# Altium schematic sheet Sensors.SchDoc
size A3
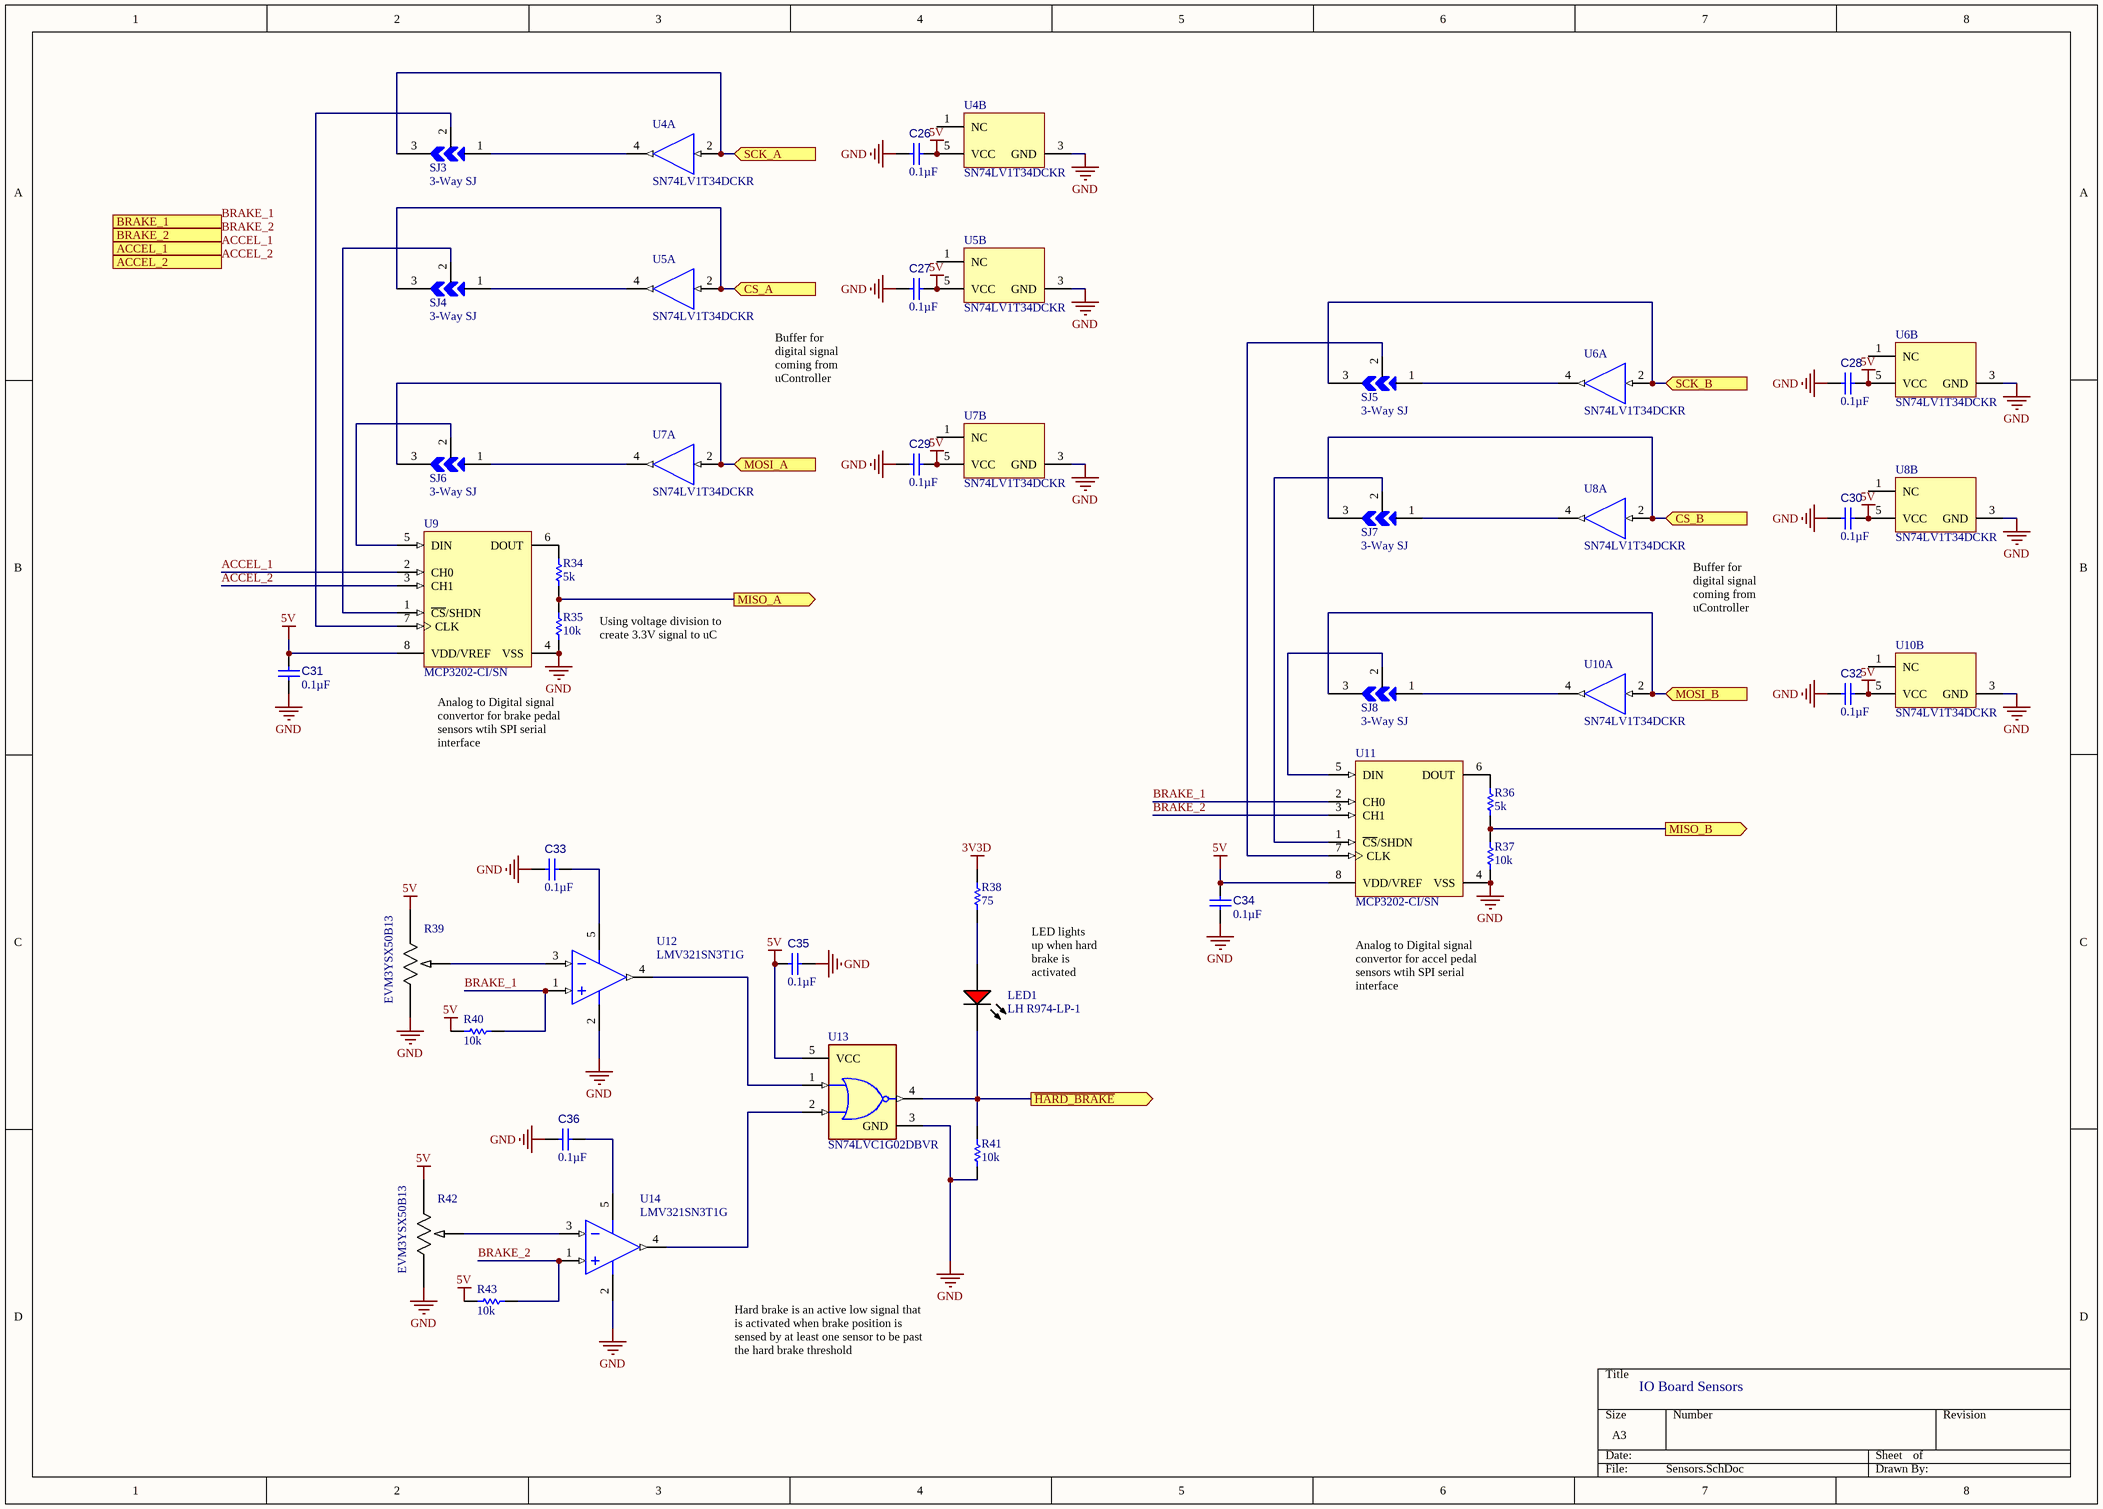
[diagram p0: Sensors.SchDoc]

## Parts
C26  0.1µF  [CAPC2013X145X50ML20T25]
C27  0.1µF  [CAPC2013X145X50ML20T25]
C28  0.1µF  [CAPC2013X145X50ML20T25]
C29  0.1µF  [CAPC2013X145X50ML20T25]
C30  0.1µF  [CAPC2013X145X50ML20T25]
C31  0.1µF  [CAPC2013X145X50ML20T25]
C32  0.1µF  [CAPC2013X145X50ML20T25]
C33  0.1µF  [CAPC2013X145X50ML20T25]
C34  0.1µF  [CAPC2013X145X50ML20T25]
C35  0.1µF  [CAPC2013X145X50ML20T25]
C36  0.1µF  [CAPC2013X145X50ML20T25]
LED1  LH R974-LP-1  [0805_A]
R34  5k  [RESC2013X50X35ML15T15]
R35  10k  [RESC2013X50X35ML15T15]
R36  5k  [RESC2013X50X35ML15T15]
R37  10k  [RESC2013X50X35ML15T15]
R38  75  [RESC2013X50X35ML15T15]
R39  EVM3YSX50B13  [POT_EVM3Y_PAN]
R40  10k  [RESC2013X50X35ML15T15]
R41  10k  [RESC2013X50X35ML15T15]
R42  EVM3YSX50B13  [POT_EVM3Y_PAN]
R43  10k  [RESC2013X50X35ML15T15]
SJ3  3-Way SJ  [3-Way SJ]
SJ4  3-Way SJ  [3-Way SJ]
SJ5  3-Way SJ  [3-Way SJ]
SJ6  3-Way SJ  [3-Way SJ]
SJ7  3-Way SJ  [3-Way SJ]
SJ8  3-Way SJ  [3-Way SJ]
U4  SN74LV1T34DCKR  [DCK0005A_L]  (parts A,B of 2)
U5  SN74LV1T34DCKR  [DCK0005A_L]  (parts A,B of 2)
U6  SN74LV1T34DCKR  [DCK0005A_L]  (parts A,B of 2)
U7  SN74LV1T34DCKR  [DCK0005A_L]  (parts A,B of 2)
U8  SN74LV1T34DCKR  [DCK0005A_L]  (parts A,B of 2)
U9  MCP3202-CI/SN  [SOIC-SN8_L]
U10  SN74LV1T34DCKR  [DCK0005A_L]  (parts A,B of 2)
U11  MCP3202-CI/SN  [SOIC-SN8_L]
U12  LMV321SN3T1G  [ONSC-TSOP-5-483-02_V]
U13  SN74LVC1G02DBVR  [FP-DBV0005A-MFG]
U14  LMV321SN3T1G  [ONSC-TSOP-5-483-02_V]

## Ports
ACCEL_1 (in), ACCEL_2 (in), BRAKE_1 (in), BRAKE_2 (in), CS_A (in), CS_B (in), MISO_A (out), MISO_B (out), MOSI_A (in), MOSI_B (in), SCK_A (in), SCK_B (in), ~{HARD_BRAKE} (out)

## Nets
3V3D: R38.1
5V: C26.1 C27.1 C28.1 C29.1 C30.1 C31.2 C32.1 C34.2 C35.2 R39.1 R40.2 R42.1 R43.2 U4.5(VCC) U5.5(VCC) U6.5(VCC) U7.5(VCC) U8.5(VCC) U9.8(VDD/VREF) U10.5(VCC) U11.8(VDD/VREF) U13.5(VCC)
GND: C26.2 C27.2 C28.2 C29.2 C30.2 C31.1 C32.2 C33.2 C34.1 C35.1 C36.2 R35.1 R37.1 R39.3 R41.1 R42.3 U4.3(GND) U5.3(GND) U6.3(GND) U7.3(GND) U8.3(GND) U9.4(VSS) U10.3(GND) U11.4(VSS) U12.2(V-) U13.3(GND) U14.2(V-)
ACCEL_1: U9.2(CH0) ; port ACCEL_1
ACCEL_2: U9.3(CH1) ; port ACCEL_2
BRAKE_1: R40.1 U11.2(CH0) U12.1(IN+) ; port BRAKE_1
BRAKE_2: R43.1 U11.3(CH1) U14.1(IN+) ; port BRAKE_2
CS_A: SJ4.3 U5.2(A) ; port CS_A
CS_B: SJ7.3 U8.2(A) ; port CS_B
~{HARD_BRAKE}: LED1.1(K) R41.2 U13.4(Y) ; port ~{HARD_BRAKE}
MISO_A: R34.2 R35.2 ; port MISO_A
MISO_B: R36.2 R37.2 ; port MISO_B
MOSI_A: SJ6.3 U7.2(A) ; port MOSI_A
MOSI_B: SJ8.3 U10.2(A) ; port MOSI_B
SCK_A: SJ3.3 U4.2(A) ; port SCK_A
SCK_B: SJ5.3 U6.2(A) ; port SCK_B
NetC33_1: C33.1 U12.5(V+)
NetC36_1: C36.1 U14.5(V+)
NetLED1_2: LED1.2(A) R38.2
NetR34_1: R34.1 U9.6(DOUT)
NetR36_1: R36.1 U11.6(DOUT)
NetR39_2: R39.2 U12.3(IN-)
NetR42_2: R42.2 U14.3(IN-)
NetSJ3_1: SJ3.1 U4.4(Y)
NetSJ3_2: SJ3.2 U9.7(CLK)
NetSJ4_1: SJ4.1 U5.4(Y)
NetSJ4_2: SJ4.2 U9.1(~{CS}/SHDN)
NetSJ5_1: SJ5.1 U6.4(Y)
NetSJ5_2: SJ5.2 U11.7(CLK)
NetSJ6_1: SJ6.1 U7.4(Y)
NetSJ6_2: SJ6.2 U9.5(DIN)
NetSJ7_1: SJ7.1 U8.4(Y)
NetSJ7_2: SJ7.2 U11.1(~{CS}/SHDN)
NetSJ8_1: SJ8.1 U10.4(Y)
NetSJ8_2: SJ8.2 U11.5(DIN)
NetU12_4: U12.4(OUT) U13.1(A)
NetU13_2: U13.2(B) U14.4(OUT)

Not connected (* = marked no-connect by the designer): U4 1(NC); U5 1(NC); U6 1(NC); U7 1(NC); U8 1(NC); U10 1(NC)

## Notes on the sheet
- Buffer for digital signal coming from uController
- Using voltage division to create 3.3V signal to uC
- Analog to Digital signal convertor for brake pedal sensors wtih SPI serial interface
- LED lights up when hard brake is activated
- Analog to Digital signal convertor for accel pedal sensors wtih SPI serial interface
- Hard brake is an active low signal that is activated when brake position is sensed by at least one sensor to be past the hard brake threshold
- IO Board Sensors

## Library data of the parts
C26-C36 = CMP-001-00010-4: Chip Capacitor, 0.1 uF, +/-10%, 25 V, 0805 (2012 Metric); Manufacturer: KEMET; Manufacturer Part Number: C0805C104K3RACTU; Dielectric Material: Ceramic; Tolerance: 10%; Capacitance: 100nF; Dielectric: X7R; Voltage: 25V; Value: 0.1µF; Supplier 1: Digi-Key; Supplier Part Number 1: 399-1168-1-ND; RoHS: Yes; Category: Ceramic Capacitors; Stock 1: 417116; Pricing 1: 1=0.14000, 10=0.10000, 50=0.05660, 100=0.04680, 500=0.03284, 1000=0.02719 (USD); Mount: Surface Mount; Case/Package: 0805; Min Operating Temperature: -55°C; Max Operating Temperature: 125°C; Packaging: Tape and Reel; Termination: SMD/SMT; Length: 2mm; Height: 0.9mm; Depth: 1.25mm; Radiation Hardening: No; ComponentLink1URL: https://datasheet.ciiva.com/18193/getdatasheetpartid-385649-18193413.pdf?src-supplier=Verical; ComponentLink1Description: https://datasheet.ciiva.com/18193/getdatasheetpartid-385649-18193413.pdf?src-supplier=Verical; ComponentLink2URL: https://datasheet.ciiva.com/7842/kem-c1002-x7r-smd-7842536.pdf?src-supplier=Element14; ComponentLink2Description: https://datasheet.ciiva.com/7842/kem-c1002-x7r-smd-7842536.pdf?src-supplier=Element14; ComponentLink3URL: https://datasheet.ciiva.com/7842/kem-c1002-x7r-smd-7842538.pdf?src-supplier=Element14; ComponentLink3Description: https://datasheet.ciiva.com/7842/kem-c1002-x7r-smd-7842538.pdf?src-supplier=Element14
LED1 = CMP-62016-000032-1: LED RED DIFFUSED 0805 SMD; Number of Elements: 1; Forward Voltage: 2.6V; Viewing Angle: 160°; Reverse Voltage: 5V; Test Current: 20mA; Dominant Wavelength: 645nm; Forward Current: 30mA; Luminous Intensity: 15mcd; Depth: 1.35mm; Min Operating Temperature: -30°C; Length: 2.1mm; Max Operating Temperature: 85°C; Radiation Hardening: No; Packaging: Tape and Reel; Number of Pins: 2; Mount: Surface Mount; Lens Style: Diffused
R34 R36 = CMP-009-00001-4: Chip Resistor, 10k Ohm, +/- 1%, 125 mW, -55 to 155 degC, 0805 (2012 Metric); Manufacturer: Panasonic; Manufacturer Part Number: ERA-6AEB4991V; Resistance: 4.99kR; Tolerance: 0.1%; Temperature Coefficient: 25ppm/°C; Power Rating: 125mW; Voltage Rating: 200V; Voltage Rating (DC): 100V; Value: 5k; Supplier 1: Digi-Key; Supplier Part Number 1: P4.99KDACT-ND; RoHS: Yes; Category: Chip SMD Resistors; Stock 1: 19262; Pricing 1: 1=0.33000, 10=0.27800, 100=0.10850, 1000=0.04541, 2500=0.04163 (USD); Mount: Surface Mount; Case/Package: 0805; Number of Pins: 2; Weight: 0.000194oz; Contact Plating: Tin; Case Code (Metric): 2012; Case Code (Imperial): 0805; Min Operating Temperature: -55°C; Max Operating Temperature: 155°C; Resistor Type: Thin Film,Metal Film; Packaging: Tape and Reel; Package Quantity: 1; Number of Terminations: 2; Termination: SMD/SMT; Max Power Dissipation: 125mW; Features: Automotive AEC-Q200; Length: 2mm; Height: 0.5mm; Width: 1.25mm; Depth: 1.25mm; Radiation Hardening: No; REACH SVHC: No SVHC; Military Standard: Not; Lead Free: Lead Free; ComponentLink1URL: https://datasheet.ciiva.com/11811/0900766b80eb1d8c-11811290.pdf?src-supplier=RSComponents; ComponentLink1Description: https://datasheet.ciiva.com/11811/0900766b80eb1d8c-11811290.pdf?src-supplier=RSComponents; ComponentLink2URL: https://datasheet.ciiva.com/26335/459226-da-01-en-widerstand-0805-era-26335808.pdf?src-supplier=Conrad; ComponentLink2Description: https://datasheet.ciiva.com/26335/459226-da-01-en-widerstand-0805-era-26335808.pdf?src-supplier=Conrad; ComponentLink3URL: https://datasheet.ciiva.com/43457/485442-43457400.pdf?src-supplier=Farnell; ComponentLink3Description: https://datasheet.ciiva.com/43457/485442-43457400.pdf?src-supplier=Farnell; ComponentLink4URL: https://datasheet.ciiva.com/24124/aoa0000ce26-197354-24124201.pdf?src-supplier=Mouser; ComponentLink4Description: https://datasheet.ciiva.com/24124/aoa0000ce26-197354-24124201.pdf?src-supplier=Mouser; ComponentLink5URL: https://datasheet.ciiva.com/6064/485442-6064426.pdf?src-supplier=Farnell; ComponentLink5Description: https://datasheet.ciiva.com/6064/485442-6064426.pdf?src-supplier=Farnell; ComponentLink6URL: https://datasheet.ciiva.com/6064/485442-6064427.pdf?src-supplier=Farnell; ComponentLink6Description: https://datasheet.ciiva.com/6064/485442-6064427.pdf?src-supplier=Farnell; ComponentLink7URL: https://datasheet.ciiva.com/17213/aoa0000ce26-17213069.pdf?src-supplier=Avnet+Europe; ComponentLink7Description: https://datasheet.ciiva.com/17213/aoa0000ce26-17213069.pdf?src-supplier=Avnet+Europe; ComponentLink8URL: https://datasheet.ciiva.com/46388/485442-46388221.pdf?src-supplier=Element14; ComponentLink8Description: https://datasheet.ciiva.com/46388/485442-46388221.pdf?src-supplier=Element14; ComponentLink9URL: https://datasheet.ciiva.com/22740/1776116-22740207.pdf?src-supplier=Element14; ComponentLink9Description: https://datasheet.ciiva.com/22740/1776116-22740207.pdf?src-supplier=Element14; ComponentLink10URL: https://datasheet.ciiva.com/46376/485442-46376911.pdf?src-supplier=Element14; ComponentLink10Description: https://datasheet.ciiva.com/46376/485442-46376911.pdf?src-supplier=Element14
R35 R37 R40 R41 R43 = CMP-009-00001-4: Chip Resistor, 10k Ohm, +/- 1%, 125 mW, -55 to 155 degC, 0805 (2012 Metric); Manufacturer: Yageo; Manufacturer Part Number: RC0805FR-0710KL; Resistance: 10kR; Temperature Coefficient: 100ppm/°C; Power Rating: 125mW; Voltage Rating: 150V; Value: 10k; Supplier 1: Digi-Key; Supplier Part Number 1: 311-10.0KCRCT-ND; RoHS: Yes; Category: Chip SMD Resistors; Stock 1: 19063106; Pricing 1: 1=0.10000, 10=0.03900, 100=0.01570, 1000=0.00705, 2500=0.00612 (USD); Case/Package: 0805; Case Code (Imperial): 0805; Case Code (Metric): 2012; Min Operating Temperature: -55°C; Max Operating Temperature: 155°C; Packaging: Tape and Reel; Tolerance: 1%; Composition: Thick Film; Package Quantity: 1; Termination: SMD/SMT; Number of Terminations: 2; Military Standard: Not; Max Power Dissipation: 125mW; Features: Moisture Resistant; Length: 2mm; Height: 0.024inch; Width: 0.049inch; Depth: 1.25mm; REACH SVHC: Unknown; Lead Free: Lead Free; ComponentLink1URL: https://datasheet.ciiva.com/11808/0900766b8106beab-11808151.pdf?src-supplier=RSComponents; ComponentLink1Description: https://datasheet.ciiva.com/11808/0900766b8106beab-11808151.pdf?src-supplier=RSComponents; ComponentLink2URL: https://datasheet.ciiva.com/12669/rc0805-12669688.pdf?src-supplier=Mouser; ComponentLink2Description: https://datasheet.ciiva.com/12669/rc0805-12669688.pdf?src-supplier=Mouser; ComponentLink3URL: https://datasheet.ciiva.com/46447/444164-46447563.pdf?src-supplier=Element14; ComponentLink3Description: https://datasheet.ciiva.com/46447/444164-46447563.pdf?src-supplier=Element14; ComponentLink4URL: https://datasheet.ciiva.com/2456/pyu-r-int-thick-7-2456972.pdf?src-supplier=Digi-Key; ComponentLink4Description: https://datasheet.ciiva.com/2456/pyu-r-int-thick-7-2456972.pdf?src-supplier=Digi-Key; ComponentLink5URL: https://datasheet.ciiva.com/2456/pyu-r-int-thick-7-2456973.pdf?src-supplier=Digi-Key; ComponentLink5Description: https://datasheet.ciiva.com/2456/pyu-r-int-thick-7-2456973.pdf?src-supplier=Digi-Key; ComponentLink6URL: https://datasheet.ciiva.com/2456/pyu-r-int-thick-7-2456974.pdf?src-supplier=Digi-Key; ComponentLink6Description: https://datasheet.ciiva.com/2456/pyu-r-int-thick-7-2456974.pdf?src-supplier=Digi-Key; ComponentLink7URL: https://datasheet.ciiva.com/16747/rc0805-16747087.pdf?src-supplier=Future+Electronics; ComponentLink7Description: https://datasheet.ciiva.com/16747/rc0805-16747087.pdf?src-supplier=Future+Electronics
R38 = CMP-009-00001-4: Chip Resistor, 10k Ohm, +/- 1%, 125 mW, -55 to 155 degC, 0805 (2012 Metric); Manufacturer: Panasonic; Manufacturer Part Number: ERA-6AEB750V; Resistance: 75R; Tolerance: 0.1%; Temperature Coefficient: 25ppm/°C; Power Rating: 125mW; Voltage Rating: 100V; Value: 75; Supplier 1: Digi-Key; Supplier Part Number 1: P75DACT-ND; RoHS: Yes; Category: Chip SMD Resistors; Stock 1: 28395; Pricing 1: 1=0.33000, 10=0.27800, 100=0.10850, 1000=0.04541, 2500=0.04163 (USD); Mount: Surface Mount; Case/Package: 0805; Number of Pins: 2; Contact Plating: Tin; Case Code (Metric): 2012; Case Code (Imperial): 0805; Min Operating Temperature: -55°C; Max Operating Temperature: 155°C; Resistor Type: Thin Film; Packaging: Tape and Reel; Package Quantity: 5000; Number of Terminations: 2; Termination: SMD/SMT; Max Power Dissipation: 125mW; Voltage Rating (DC): 100V; Length: 2mm; Height: 0.024inch; Width: 0.049inch; Depth: 1.25mm; Radiation Hardening: No; REACH SVHC: Yes; Military Standard: Not; Lead Free: Lead Free; ComponentLink1URL: https://datasheet.ciiva.com/29184/452659-da-01-en-widerstand-0805-era-29184043.pdf?src-supplier=Conrad; ComponentLink1Description: https://datasheet.ciiva.com/29184/452659-da-01-en-widerstand-0805-era-29184043.pdf?src-supplier=Conrad; ComponentLink2URL: https://datasheet.ciiva.com/5917/485442-5917734.pdf?src-supplier=Farnell; ComponentLink2Description: https://datasheet.ciiva.com/5917/485442-5917734.pdf?src-supplier=Farnell; ComponentLink3URL: https://datasheet.ciiva.com/48536/era-eng-tds-48536758.pdf?src-supplier=Distrelec; ComponentLink3Description: https://datasheet.ciiva.com/48536/era-eng-tds-48536758.pdf?src-supplier=Distrelec; ComponentLink4URL: https://datasheet.ciiva.com/5917/485442-5917735.pdf?src-supplier=Farnell; ComponentLink4Description: https://datasheet.ciiva.com/5917/485442-5917735.pdf?src-supplier=Farnell; ComponentLink5URL: https://datasheet.ciiva.com/5917/485442-5917736.pdf?src-supplier=Farnell; ComponentLink5Description: https://datasheet.ciiva.com/5917/485442-5917736.pdf?src-supplier=Farnell; ComponentLink6URL: https://datasheet.ciiva.com/7710/485442-7710664.pdf?src-supplier=Element14; ComponentLink6Description: https://datasheet.ciiva.com/7710/485442-7710664.pdf?src-supplier=Element14; ComponentLink7URL: https://datasheet.ciiva.com/7710/485442-7710665.pdf?src-supplier=Element14; ComponentLink7Description: https://datasheet.ciiva.com/7710/485442-7710665.pdf?src-supplier=Element14; ComponentLink8URL: https://datasheet.ciiva.com/17208/aoa0000ce26-17208633.pdf?src-supplier=Avnet+Europe; ComponentLink8Description: https://datasheet.ciiva.com/17208/aoa0000ce26-17208633.pdf?src-supplier=Avnet+Europe; ComponentLink9URL: https://datasheet.ciiva.com/9187/aoa0000ce26-9187722.pdf?src-supplier=Avnet; ComponentLink9Description: https://datasheet.ciiva.com/9187/aoa0000ce26-9187722.pdf?src-supplier=Avnet; ComponentLink10URL: https://datasheet.ciiva.com/48425/era-eng-tds-48425627.pdf?src-supplier=Distrelec; ComponentLink10Description: https://datasheet.ciiva.com/48425/era-eng-tds-48425627.pdf?src-supplier=Distrelec; ComponentLink11URL: https://datasheet.ciiva.com/30147/54aoa0000ce26-30147167.pdf?src-supplier=Onlinecomponents.com; ComponentLink11Description: https://datasheet.ciiva.com/30147/54aoa0000ce26-30147167.pdf?src-supplier=Onlinecomponents.com
R39 R42 = EVM3YSX50B13: Panasonic EVM-3YSX50B13; Built_By: EMA_UL_Team; SourceLibrary: Panasonic_2012-04-02a; Vendor: Panasonic; Manufacturer_Part_Number: EVM3YSX50B13; Copyright: Copyright (C) 2018 Accelerated Designs. All rights reserved; RefDes: RefDes; Type: DEV
SJ3-SJ8 = 3-Way SJ: 3-Way Solder Jumper
U4-U8 U10 = CMP-0859-00371-3: Single Power Supply BUFFER Logic Level Shifter (no enable), DCK0005A, LARGE T&R; Manufacturer: Texas Instruments; 3-State Output: Yes; Sub-Family: Non-Inverting Buffer/Driver; Rating: Catalog; ICC @ Nom Voltage(Max)(mA): 0.01; Logic: True; tpd @ Nom Voltage(Max)(ns): 14.5,9.5,8.0,6.5; Output Type: CMOS; VCC(Max)(V): 5.5; Voltage(Nom)(V): 1.8,2.5,3.3,5.5; Bits(#): 1; Output Drive (IOL/IOH)(Max)(mA): 8/-8; F @ Nom Voltage(Max)(Mhz): 50; Special Features: 1.8V to 3.3V Up Translation,3.3V to 1.8V Down Translation,5V Input Tolerant; Input Type: TTL; Technology Family: LV1T; VCC(Min)(V): 1.6; Operating Temperature Range(C): -40 to 125; DatasheetVersion: SCLS743A; Generic Part Number: SN74LV1T34; PackageReference: DCK0005A; Schmitt Trigger: No
U9 U11 = CMP-0188-00474-2: 2.7V Dual Channel 12-Bit A/D Converter with SPI Serial Interface, 8-Pin SOIC 150mil, C Performance Grade, Industrial Temperature; ComponentLink2URL: http://ww1.microchip.com/downloads/en/DeviceDoc/21034F.pdf; DatasheetVersion: revF, Nov-2011; ComponentLink1URL: http://www.microchip.com/; PackageDescription: 8-Lead Plastic Small Outline (SN) - Narrow, 3.90mm Body [SOIC]; ComponentLink3Description: Package Specification; PackageReference: SOIC-SN8; ComponentLink2Description: Datasheet; Code_JEDEC: MS-012; Code_IPC: SOIC127P600-8; PackageVersion: revBB, Aug-2009; ComponentLink3URL: http://www.microchip.com/stellent/groups/techpub_sg/documents/packagingspec/en012702.pdf; RevisionNote: URLs added. DatasheetVersion updated.; ComponentLink1Description: Manufacturer URL
U12 U14 = CMP-1310-00382-1: Single Low-Voltage, Rail-to-Rail Operational Amplifier, 2.7 to 5.5 V, -40 to 85 degC, 5-Pin TSOP, Pb-Free, Tape and Reel; Manufacturer: On Semiconductor; SR Typ (V/uS): 1; VCC Min (V): 2.7; VCC Max (V): 5.5; DatasheetVersion: Rev. 10; ComponentLink3Description: Package Specification; PackageDescription: 5-Pin Small Outline Package, Body 3 x 1.5 mm, Pitch 0.95 mm; ComponentLink1Description: Manufacturer URL; ComponentLink2URL: http://www.onsemi.cn/pub_link/Collateral/LMV321-LMV358-LMV324-D.PDF; GBW Typ (MHz): 1; ComponentLink3URL: http://www.onsemi.com/pub_link/Collateral/483.PDF; RoHS: TRUE; Packing: Tape and Reel; ComponentLink2Description: Datasheet; PackageReference: TSOP-5-483-02; ComponentLink1URL: http://www.onsemi.com/; PackageVersion: Rev. K, 04/2013; Mounting Technology: Surface Mount; PartNumber: LMV321SN3T1G
U13 = CMP-04903-000054-1: IC GATE NOR 1CH 2-INP SOT23-5; Manufacturer: Texas Instruments; Nominal Supply Current: 10uA; Frequency: 100MHz; Propagation Delay: 4.5ns; Number Of Circuits: 1; Max Supply Voltage: 5.5V; Min Supply Voltage: 1.65V; Standoff Height: 0mm; Number Of Inputs: 2; Manufacturer Part Number: SN74LVC1G02DBVR; Logic Function Desc: NOR; Ambient Temperature Range High: +125°C; Height: 1.45mm; RoHS: TRUE; ComponentLink2Description: Datasheet; Automotive: No; Device Class L2: Logic ICs; Temperature: -40°C to +125°C; Ambient Temperature Range Low: -40°C; Temperature Range Low: -40°C; Device Class L1: Integrated Circuits (ICs); Lead Free: Yes; Mouser Description: Logic Gates Single 2-Input Pos- NOR Gate; Category: IC; Number Of Outputs: 1; Digikey Description: IC GATE NOR 1CH 2-INP SOT23-5; Device Class L3: Logic Gates; Octopart: https://octopart.com/sn74lvc1g02dbvr-texas+instruments-464409; ComponentLink2URL: http://www.ti.com/lit/ds/symlink/sn74lvc1g02.pdf; Package: DBV0005A; Ipc Land Pattern Name: SOT95P280X145-5; Temperature Range High: +125°C